# Altium project TSC-Lab.PrjPcb
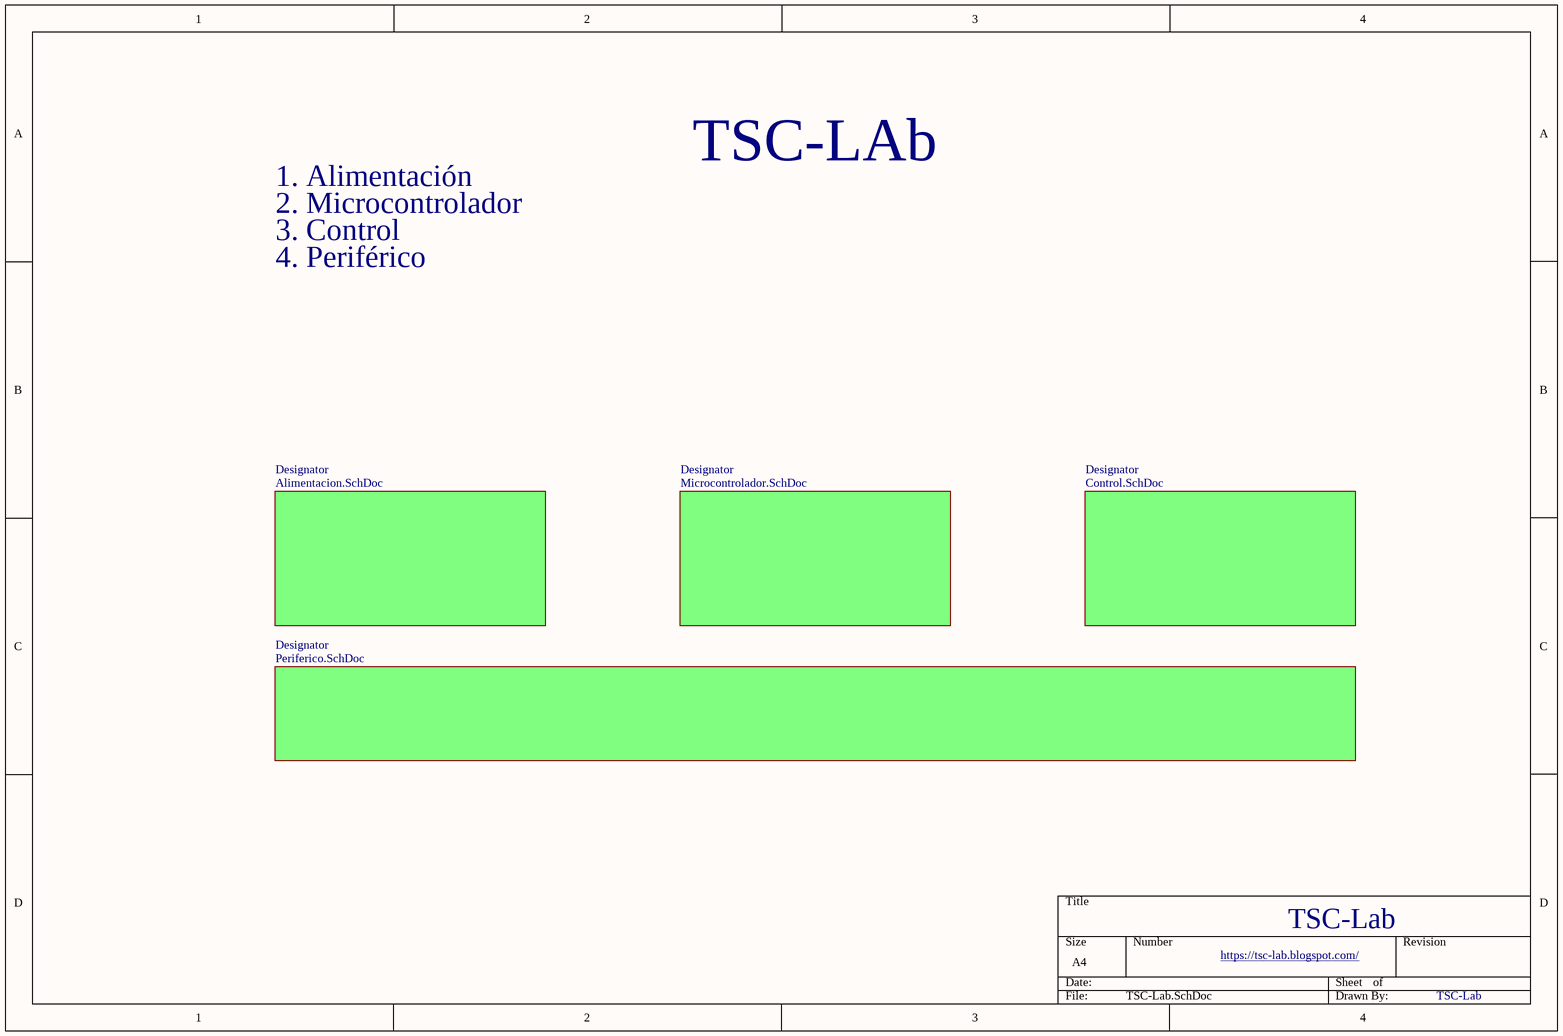
[diagram p0: TSC-Lab.SchDoc]
5 sheets, 25 parts. Net scope: global (net labels, ports and power ports of the same name join across sheets).
Board file: TSC-Lab_pcb.PcbDoc
Sheets:
  TSC-Lab.SchDoc
    Designator = Alimentacion.SchDoc
    Designator = Microcontrolador.SchDoc
    Designator = Control.SchDoc
    Designator = Periferico.SchDoc

## Sheet TSC-Lab.SchDoc
size A4

### Sub-sheets
Designator = Alimentacion.SchDoc: no entries
Designator = Microcontrolador.SchDoc: no entries
Designator = Control.SchDoc: no entries
Designator = Periferico.SchDoc: no entries

### Notes on the sheet
- TSC-LAb
- 1. Alimentación
- 2. Microcontrolador
- 3. Control
- 4. Periférico
- https://tsc-lab.blogspot.com/
- TSC-Lab

## Sheet Alimentacion.SchDoc
size A4
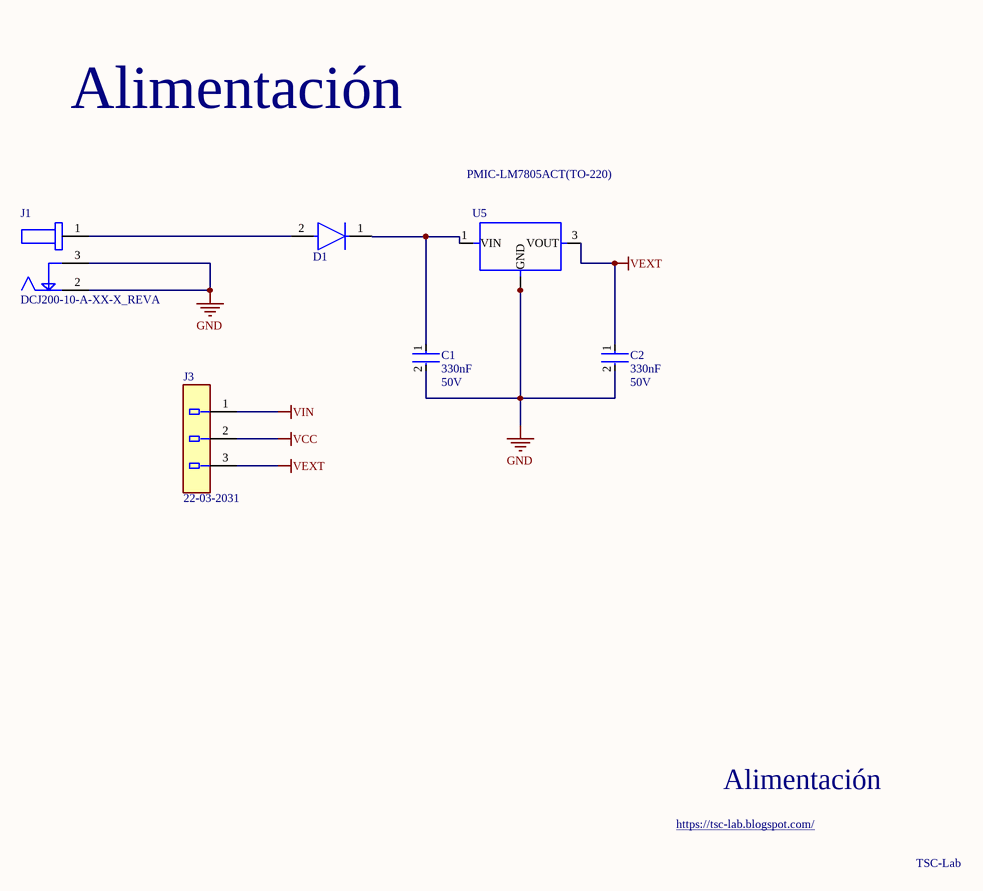
[diagram p1: Alimentacion.SchDoc]

### Parts
C1  Capacitance: 330nF  Voltage: 50V  [Kemet_C322C334M5U5TA7301_0]  (hidden comment: Cap_Kemet_C322C334M5U5TA7301_eec)
C2  Capacitance: 330nF  Voltage: 50V  [Kemet_C322C334M5U5TA7301_0]  (hidden comment: Cap_Kemet_C322C334M5U5TA7301_eec)
D1  Diode_Vishay_1N4001E-E3-54_eec  [Vishay_1N4001E-E3-54_0]  (value not drawn)
J1  DCJ200-10-A-XX-X_REVA  [GCT_DCJ200-10-A-XX-X_REVA]
J3  Part Number: 22-03-2031  [Molex_SD-4030-0001_0]  (hidden comment: Conn_Molex_22-03-2031_eec)
U5  PMIC-LM7805ACT(TO-220)  [TO-220]

### Nets
GND: C1.2 C2.2 J1.2 J1.3 U5.2(GND) U5.HEAT(GND)
VCC: J3.2
VEXT: C2.1 J3.3 U5.3(VOUT)
VIN: J3.1
NetC1_1: C1.1 D1.1(C) U5.1(VIN)
NetD1_2: D1.2(A) J1.1

### Notes on the sheet
- Alimentación
- https://tsc-lab.blogspot.com/
- TSC-Lab

### Library data of the parts
C1 C2 = Cap_Kemet_C322C334M5U5TA7301_eec: CAP CER 0.33UF 50V Z5U RADIAL; Manufacturer: Kemet; Value: 330nF; Part Number: C322C334M5U5TA7301; helpURL: https://upverter.com/upn/revision/a7e23f606e787d17/; ComponentLink2Description: Datasheet; Temperature: -10°C to +85°C; Package: AXIAL; Supplier 2: Mouser; Price: 0.206679296795; Supplier 1: Digi-Key; ComponentLink1URL: https://upverter.com/upn/revision/a7e23f606e787d17/; Supplier Part Number 2: 80-C322C334M5U-TR; Supplier Part Number 1: 399-9882-1-ND; ComponentLink1Description: Upverter; ComponentLink2URL: http://www.mouser.com/ds/2/212/KEM_C1051_GOLDMAX_Z5U-1140498.pdf; RoHS: TRUE; Mouser Part Number: 80-C322C334M5U-TR; Temperature Range High: +85°C; Digikey Description: CAP CER 0.33UF 50V Z5U RADIAL; Digikey Part Number: 399-9882-1-ND; Lead Free: yes; Temperature Range Low: -10°C
D1 = Diode_Vishay_1N4001E-E3-54_eec: DIODE GEN PURP 50V 1A DO204AL; Part Number: 1N4001E-E3/54; Manufacturer: Vishay; Diode Type: Standard; Voltage - Forward (Vf) (Max) @ If: 1.1V @ 1A; Capacitance @ Vr, F: 15pF @ 4V, 1MHz; Current - Reverse Leakage @ Vr: 5µA @ 50V; Speed: Standard Recovery >500ns, > 200mA (Io); Other Names: IN4001E-E3/54; helpURL: https://upverter.com/upn/revision/7d4f72d520b50cd6/; ComponentLink2Description: Datasheet; Temperature: -50°C to +150°C; Package: DO41; Supplier 2: Mouser; Supplier 1: Digi-Key; ComponentLink1URL: https://upverter.com/upn/revision/7d4f72d520b50cd6/; Supplier Part Number 2: 625-1N4001E-E3/54; Supplier Part Number 1: 1N4001E-E3/54GICT-ND; Voltage: 50V; ComponentLink1Description: Upverter; ComponentLink2URL: http://www.vishay.com/doc?88503; RoHS: TRUE; Mouser Part Number: 625-1N4001E-E3/54; Ipc Land Pattern Name: DIOAD852W85L465D235; Temperature Range High: +150°C; Digikey Description: DIODE GEN PURP 50V 1A DO204AL; Digikey Part Number: 1N4001E-E3/54GICT-ND; Standard Package: 5,500; Current - Average Rectified (Io): 1A; Lead Free: yes; Voltage - DC Reverse (Vr) (Max): 50V; Temperature Range Low: -50°C; Mounting Type: Through Hole; Packaging: Tape & Reel (TR)
J1 = DCJ200-10-A-XX-X_REVA: DC Power Jack, Thru-Hole, Horizontal, with Locating Pegs, D2.0mm; MF: {'manufacturer': u'Global Connector Technology'}; Price: None; Package: None; Availability: Unavailable; Value: *; MP: DCJ200-10-A-XX-X_REVA
J3 = Conn_Molex_22-03-2031_eec: CONN HEADER 3POS .100 VERT TIN; Manufacturer: Molex; Voltage: 150V; Circuits_Loaded: 3; Current___Maximum_per_Contact: 4.0A; Mfg Package Ident: SD-4030-0001; helpURL: https://upverter.com/upn/revision/895d404c69e3c851/; ComponentLink2Description: Datasheet; Temperature: -40°C to +80°C; Package: SD-4030-0001; Supplier 2: Mouser; Price: 0.17996592642; Supplier 1: Digi-Key; ComponentLink1URL: https://upverter.com/upn/revision/895d404c69e3c851/; Supplier Part Number 2: 538-22-03-2031; Supplier Part Number 1: WM4001-ND; ComponentLink1Description: Upverter; ComponentLink2URL: http://www.molex.com/pdm_docs/sd/022032031_sd.pdf; RoHS: TRUE; Mouser Part Number: 538-22-03-2031; Temperature Range High: +80°C; Flammability: 94V-0; Digikey Description: CONN HEADER 3POS .100 VERT TIN; Digikey Part Number: WM4001-ND; Type: connector; Lead Free: yes; Temperature Range Low: -40°C; Num Pins: 3
U5 = PMIC-LM7805ACT(TO-220): 310030049; MF: {'manufacturer': u'ON Semiconductor'}; MP: LM7805ACT; Value: *; Package: None; Price: None; Availability: Unavailable

## Sheet Microcontrolador.SchDoc
size A4
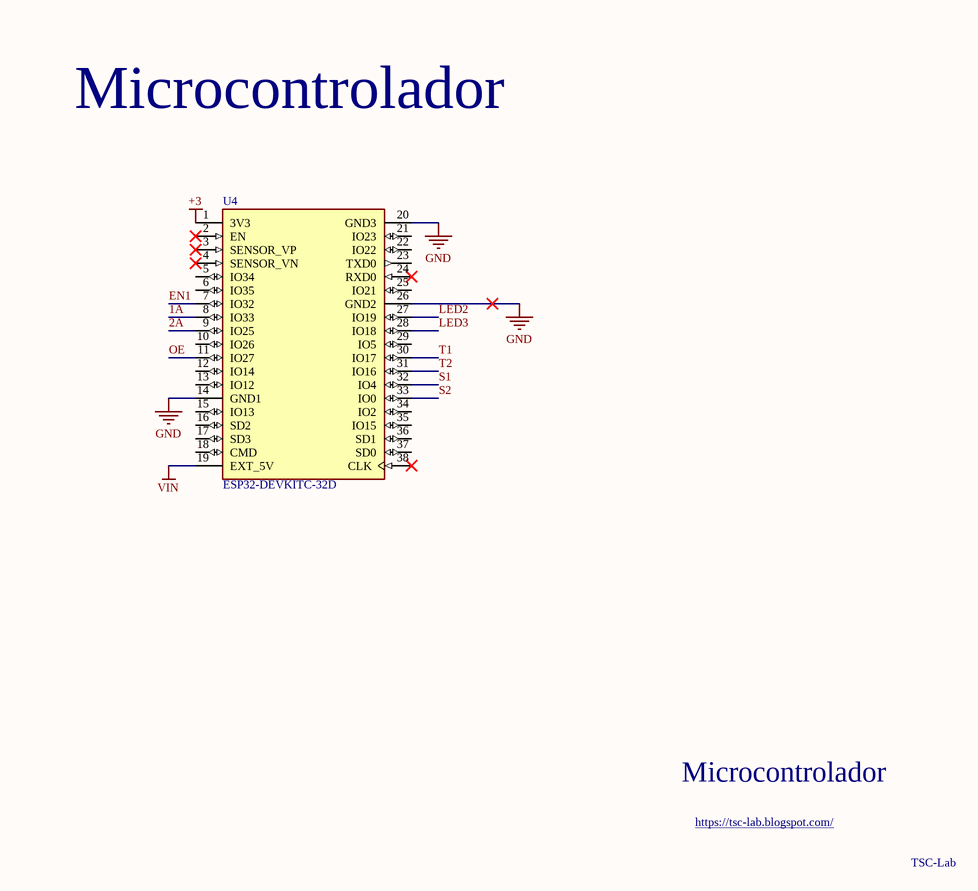
[diagram p2: Microcontrolador.SchDoc]

### Parts
U4  ESP32-DEVKITC-32D  [MODULE_ESP32-DEVKITC-32D]

### Nets
+3: U4.1(3V3)
GND: U4.14(GND1) U4.20(GND3) U4.26(GND2)
VIN: U4.19(EXT_5V)
1A: U4.8(IO33)
2A: U4.9(IO25)
EN1: U4.7(IO32)
LED2: U4.27(IO19)
LED3: U4.28(IO18)
OE: U4.11(IO27)
S1: U4.32(IO4)
S2: U4.33(IO0)
T1: U4.30(IO17)
T2: U4.31(IO16)

Not connected (* = marked no-connect by the designer): U4 2(EN)* 3(SENSOR_VP)* 4(SENSOR_VN)* 5(IO34) 6(IO35) 10(IO26) 12(IO14) 13(IO12) 15(IO13) 16(SD2) 17(SD3) 18(CMD) 21(IO23) 22(IO22) 23(TXD0) 24(RXD0)* 25(IO21) 29(IO5) 34(IO2) 35(IO15) 36(SD1) 37(SD0) 38(CLK)*

### Notes on the sheet
- Microcontrolador
- https://tsc-lab.blogspot.com/
- TSC-Lab

### Library data of the parts
U4 = ESP32-DEVKITC-32D: Eval Board For Esp-Wroom-32; MF: {'manufacturer': u'Espressif Systems'}; Availability: Unavailable; MP: ESP32-DEVKITC-32D; Price: None; Value: *; Package: None

## Sheet Control.SchDoc
size A4
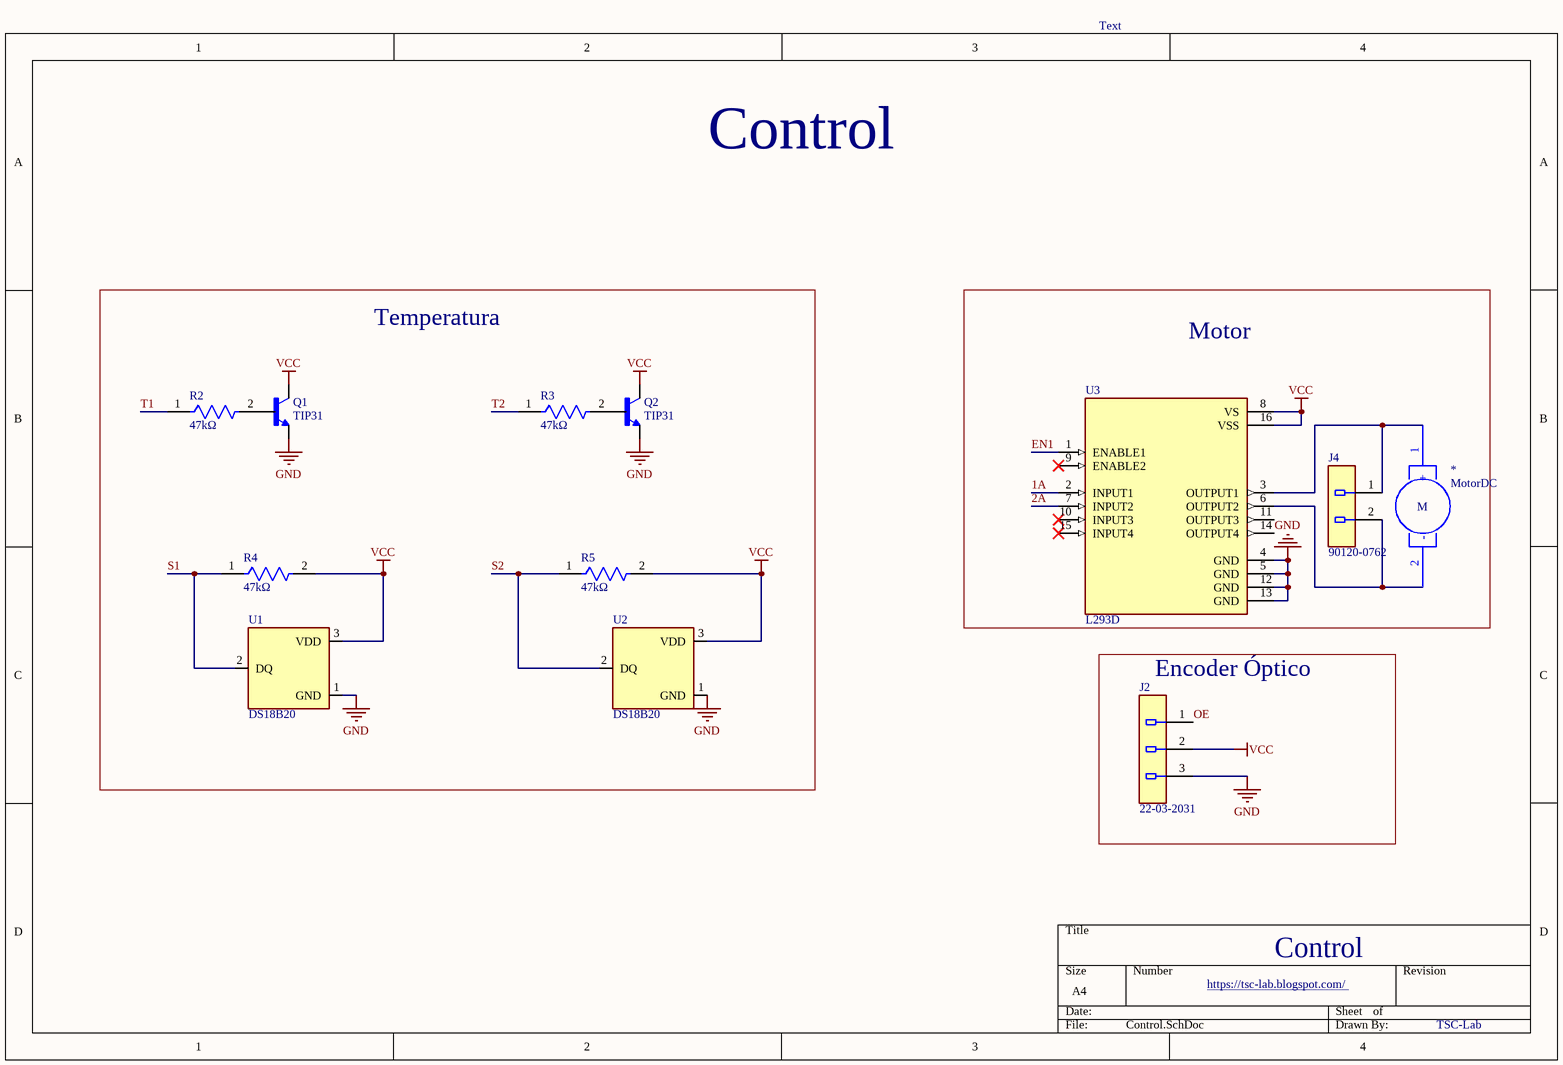
[diagram p3: Control.SchDoc]

### Parts
*  MotorDC  [PCBComponent_1]
J2  Part Number: 22-03-2031  [Molex_SD-4030-0001_0]  (hidden comment: Conn_Molex_22-03-2031_eec)
J4  Part Number: 90120-0762  [Molex_90120-0762_0]  (hidden comment: Conn_Molex_90120-0762_eec)
Q1  TIP31  [TO254P1060X482X2222-3]
Q2  TIP31  [TO254P1060X482X2222-3]
R2  Resistance: 47kΩ  [Vishay_SFR2500002200FR500_0]  (hidden comment: Res_Vishay_SFR2500002200FR500_eec)
R3  Resistance: 47kΩ  [Vishay_SFR2500002200FR500_0]  (hidden comment: Res_Vishay_SFR2500002200FR500_eec)
R4  Resistance: 47kΩ  [Vishay_SFR2500002200FR500_0]  (hidden comment: Res_Vishay_SFR2500002200FR500_eec)
R5  Resistance: 47kΩ  [Vishay_SFR2500002200FR500_0]  (hidden comment: Res_Vishay_SFR2500002200FR500_eec)
U1  DS18B20  [TO-92-TO92127P495H2044-3]
U2  DS18B20  [TO-92-TO92127P495H2044-3]
U3  L293D  [DIP880W50P254L2000H510Q16]

### Blocks framed on the sheet
Temperatura: Q1 Q2 R2-R5 U1 U2
Motor: * J4 U3
Encoder Óptico: J2

### Nets
GND: J2.3 Q1.3(E) Q2.3(E) U1.1(GND) U2.1(GND) U3.4(GND) U3.5(GND) U3.12(GND) U3.13(GND)
VCC: J2.2 Q1.2(C) Q2.2(C) R4.2 R5.2 U1.3(VDD) U2.3(VDD) U3.8(VS) U3.16(VSS)
1A: U3.2(INPUT1)
2A: U3.7(INPUT2)
EN1: U3.1(ENABLE1)
OE: J2.1
S1: R4.1 U1.2(DQ)
S2: R5.1 U2.2(DQ)
T1: R2.1
T2: R3.1
Net*_1: *.1(+) J4.1 U3.3(OUTPUT1)
Net*_2: *.2(-) J4.2 U3.6(OUTPUT2)
NetQ1_1: Q1.1(B) R2.2
NetQ2_1: Q2.1(B) R3.2

Not connected (* = marked no-connect by the designer): U3 9(ENABLE2)* 10(INPUT3)* 11(OUTPUT3) 14(OUTPUT4) 15(INPUT4)*

### Notes on the sheet
- Text
- Control
- https://tsc-lab.blogspot.com/ <https://tsc-lab.blogspot.com/ >
- TSC-Lab
- (in symbol MotorDC) M

### Library data of the parts
J2 = Conn_Molex_22-03-2031_eec: as J3 on sheet Alimentacion; helpURL: https://upverter.com/upn/revision/895d404c69e3c851/; ComponentLink2Description: Datasheet; Temperature: -40°C to +80°C; Package: SD-4030-0001; Supplier 2: Mouser; Price: 0.17996592642; Supplier 1: Digi-Key; ComponentLink1URL: https://upverter.com/upn/revision/895d404c69e3c851/; Supplier Part Number 2: 538-22-03-2031; Supplier Part Number 1: WM4001-ND; ComponentLink1Description: Upverter; ComponentLink2URL: http://www.molex.com/pdm_docs/sd/022032031_sd.pdf; RoHS: TRUE; Mouser Part Number: 538-22-03-2031; Temperature Range High: +80°C; Flammability: 94V-0; Digikey Description: CONN HEADER 3POS .100 VERT TIN; Digikey Part Number: WM4001-ND; Type: connector; Lead Free: yes; Temperature Range Low: -40°C; Num Pins: 3
J4 = Conn_Molex_90120-0762_eec: CONN HEADER 2POS .100" STR GOLD; Manufacturer: Molex; helpURL: https://upverter.com/upn/revision/2e8a16f42ccfe3ab/; ComponentLink2Description: Datasheet; Temperature: -55°C to +125°C; Package: CONN_PTH_HDR2; Supplier 2: Mouser; Supplier 1: Digi-Key; ComponentLink1URL: https://upverter.com/upn/revision/2e8a16f42ccfe3ab/; Supplier Part Number 2: 538-90120-0762; Supplier Part Number 1: WM8084-ND; ComponentLink1Description: Upverter; ComponentLink2URL: http://www.molex.com/pdm_docs/sd/901200761_sd.pdf; RoHS: TRUE; Mouser Part Number: 538-90120-0762; Temperature Range High: +125°C; Digikey Description: CONN HEADER 2POS .100" STR GOLD; Digikey Part Number: WM8084-ND; Temperature Range Low: -55°C; Lead Free: yes
Q1 Q2 = TIP31: Bipolar (BJT) Transistor NPN 40V 3A 3MHz 2W Through Hole TO-220AB; MF: {'manufacturer': u'ON Semiconductor'}; Price: None; Availability: Unavailable; MP: TIP31; Value: *; Package: None
R2-R5 = Res_Vishay_SFR2500002200FR500_eec: RES 220 OHM 0.4W 1% AXIAL; Manufacturer: Vishay; Voltage: 250 V; Value: 220Ω; power_rating: 400 mW; Category 7542B8484461Ae85: Passive Components; Category 5A00970A6D5C81C7: Uncategorized; Category 5C6A91606D4187Ad: Resistors; Power: 400mW; Category Cd01000Bfc2916C6: Single Components; Symbol 0 0: Resistor; Num Pins: 2; Part Number: SFR2500002200FR500; helpURL: https://upverter.com/upn/revision/077f2be647fd95a8/; ComponentLink2Description: Datasheet; Temperature: -55°C to +155°C; Package: AXIAL; Supplier 2: Mouser; Price: 0.0503066408853; Supplier 1: Digi-Key; ComponentLink1URL: https://upverter.com/upn/revision/077f2be647fd95a8/; Supplier Part Number 2: 594-5043ED220R0F; Supplier Part Number 1: PPC220YCT-ND; ComponentLink1Description: Upverter; ComponentLink2URL: http://www.vishay.com/docs/28722/sfr16s25.pdf; RoHS: TRUE; Mouser Part Number: 594-5043ED220R0F; Operating temperature range: -55 °C to 155 °C; voltage_rating_dc: 250 V; Ipc Land Pattern Name: RESAD1076W80L750D250; Tolerance: 1%; Temperature Range High: +155°C; Octopart Part Number: d6c31f7a8f400904; Digikey Description: RES 220 OHM 0.4W 1% AXIAL; Digikey Part Number: PPC220YCT-ND; Type: resistor; Lead Free: yes; Temperature Range Low: -55°C
U1 U2 = DS18B20: digital thermometer -55C-125C TO92-3; MF: {'manufacturer': u'Maxim Integrated'}; Value: *; MP: DS18B20; Availability: Unavailable; Price: None; Package: None
U3 = L293D: 4-Channel Motor Driver 24V 16-Pin Power PDIP Tube; MF: {'manufacturer': u'STMicroelectronics'}; Availability: Unavailable; MP: L293D; Price: None; Value: *; Package: None

## Sheet Periferico.SchDoc
size A4
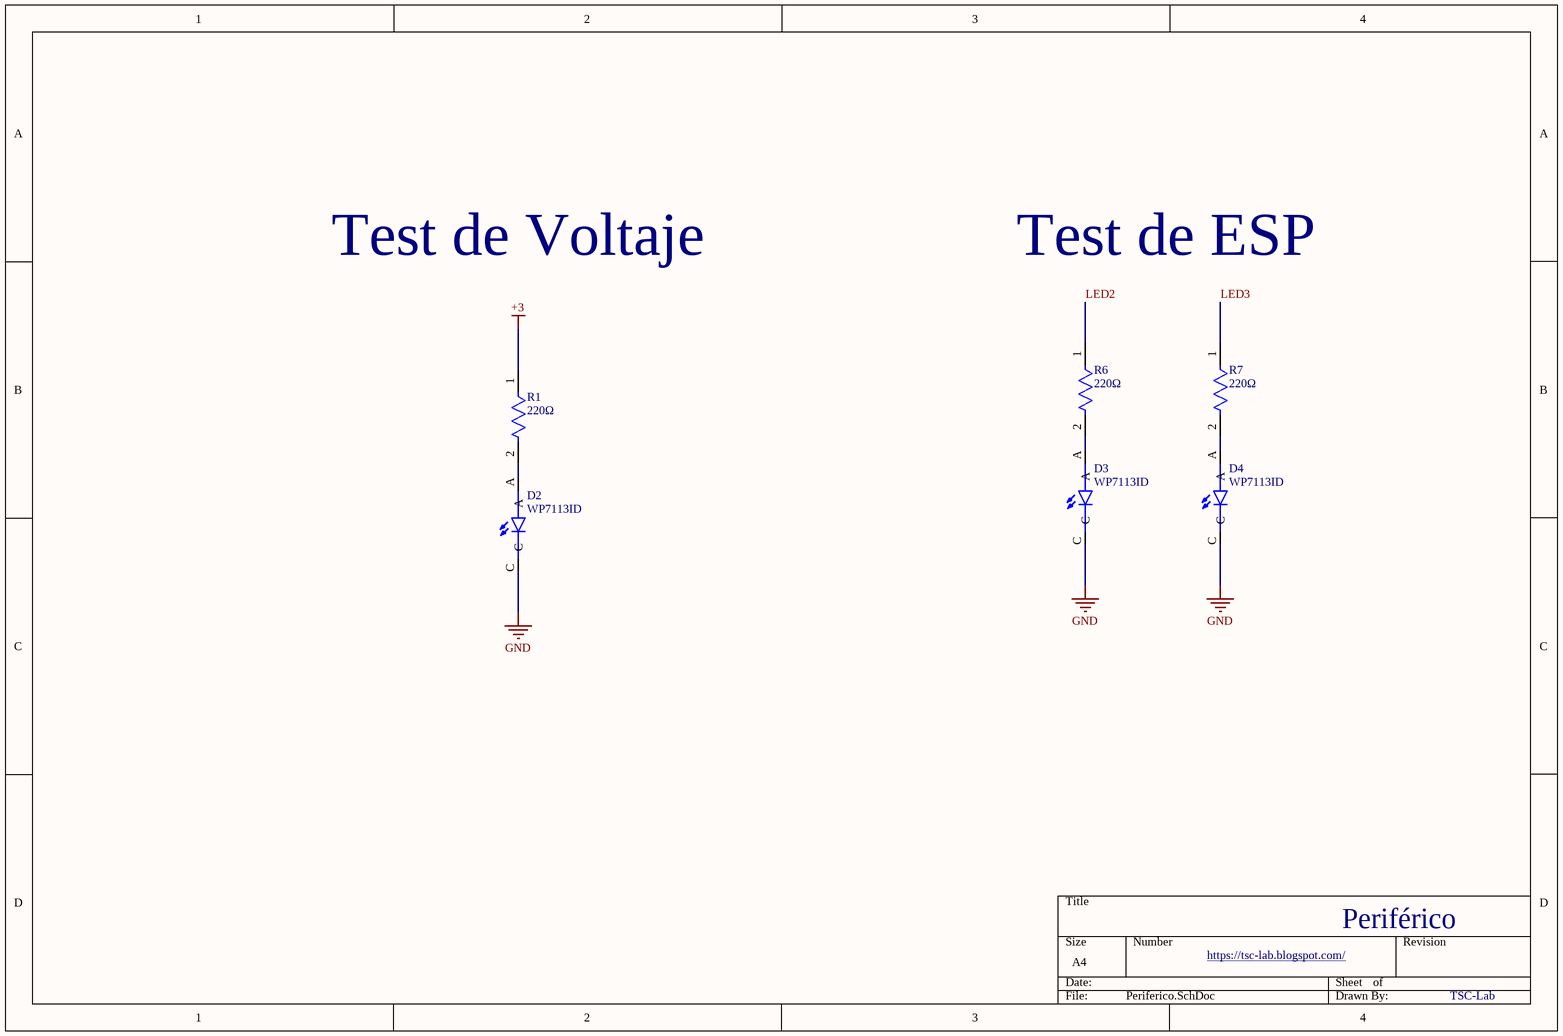
[diagram p4: Periferico.SchDoc]

### Parts
D2  WP7113ID  [LED_WP7113ID]
D3  WP7113ID  [LED_WP7113ID]
D4  WP7113ID  [LED_WP7113ID]
R1  Resistance: 220Ω  [Vishay_SFR2500002200FR500_0]  (hidden comment: Res_Vishay_SFR2500002200FR500_eec)
R6  Resistance: 220Ω  [Vishay_SFR2500002200FR500_0]  (hidden comment: Res_Vishay_SFR2500002200FR500_eec)
R7  Resistance: 220Ω  [Vishay_SFR2500002200FR500_0]  (hidden comment: Res_Vishay_SFR2500002200FR500_eec)

### Nets
+3: R1.1
GND: D2.C D3.C D4.C
LED2: R6.1
LED3: R7.1
NetD2_A: D2.A R1.2
NetD3_A: D3.A R6.2
NetD4_A: D4.A R7.2

### Notes on the sheet
- Test de Voltaje
- Test de ESP
- https://tsc-lab.blogspot.com/
- Periférico
- TSC-Lab

### Library data of the parts
D2-D4 = WP7113ID: LED; Thru-Hole; Green; T1-3/4; 5mm; Clear Lens; 25ma; 565nm; 200mcd; Round; MF: {'manufacturer': u'Kingbright'}; Package: None; Price: None; Availability: Unavailable; MP: WP7113ID; Value: *
R1 R6 R7 = Res_Vishay_SFR2500002200FR500_eec: as R2 on sheet Control; Part Number: SFR2500002200FR500; helpURL: https://upverter.com/upn/revision/077f2be647fd95a8/; ComponentLink2Description: Datasheet; Temperature: -55°C to +155°C; Package: AXIAL; Supplier 2: Mouser; Price: 0.0503066408853; Supplier 1: Digi-Key; ComponentLink1URL: https://upverter.com/upn/revision/077f2be647fd95a8/; Supplier Part Number 2: 594-5043ED220R0F; Supplier Part Number 1: PPC220YCT-ND; ComponentLink1Description: Upverter; ComponentLink2URL: http://www.vishay.com/docs/28722/sfr16s25.pdf; RoHS: TRUE; Mouser Part Number: 594-5043ED220R0F; Operating temperature range: -55 °C to 155 °C; voltage_rating_dc: 250 V; Ipc Land Pattern Name: RESAD1076W80L750D250; Tolerance: 1%; Temperature Range High: +155°C; Octopart Part Number: d6c31f7a8f400904; Digikey Description: RES 220 OHM 0.4W 1% AXIAL; Digikey Part Number: PPC220YCT-ND; Type: resistor; Lead Free: yes; Temperature Range Low: -55°C

## Nets that join several sheets
+3: Microcontrolador (U4.1), Periferico (R1.1)
GND: Alimentacion (6 pins), Microcontrolador (U4.14 U4.20 U4.26), Control (9 pins), Periferico (D2.C D3.C D4.C)
VCC: Alimentacion (J3.2), Control (9 pins)
VIN: Alimentacion (J3.1), Microcontrolador (U4.19)
1A: Microcontrolador (U4.8), Control (U3.2)
2A: Microcontrolador (U4.9), Control (U3.7)
EN1: Microcontrolador (U4.7), Control (U3.1)
LED2: Microcontrolador (U4.27), Periferico (R6.1)
LED3: Microcontrolador (U4.28), Periferico (R7.1)
OE: Microcontrolador (U4.11), Control (J2.1)
S1: Microcontrolador (U4.32), Control (R4.1 U1.2)
S2: Microcontrolador (U4.33), Control (R5.1 U2.2)
T1: Microcontrolador (U4.30), Control (R2.1)
T2: Microcontrolador (U4.31), Control (R3.1)